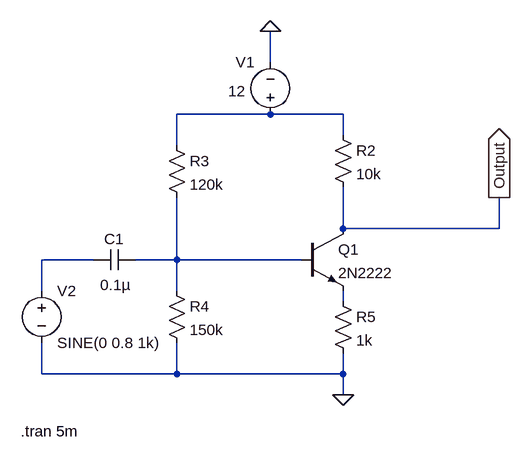
[diagram p0: schematic q3_1.asc]
q3_1.asc, the LTspice schematic file:
Version 4
SHEET 1 1488 680
WIRE -48 -176 -48 -224
WIRE -48 -96 -192 -96
WIRE 64 -96 -48 -96
WIRE 64 -64 64 -96
WIRE -192 -48 -192 -96
WIRE 64 80 64 16
WIRE 304 80 304 32
WIRE 304 80 64 80
WIRE -320 128 -400 128
WIRE -192 128 -192 32
WIRE -192 128 -256 128
WIRE 0 128 -192 128
WIRE -400 176 -400 128
WIRE -192 176 -192 128
WIRE 64 192 64 176
WIRE -400 304 -400 256
WIRE -192 304 -192 256
WIRE -192 304 -400 304
WIRE 64 304 64 272
WIRE 64 304 -192 304
WIRE 64 336 64 304
FLAG -48 -224 0
FLAG 64 336 0
FLAG 304 32 Output
IOPIN 304 32 Out
SYMBOL npn 0 80 R0
SYMATTR InstName Q1
SYMATTR Value 2N2222
SYMBOL res 48 -80 R0
SYMATTR InstName R2
SYMATTR Value 10k
SYMBOL voltage -48 -80 R180
WINDOW 0 24 96 Left 2
WINDOW 3 38 52 Left 2
WINDOW 123 0 0 Left 0
WINDOW 39 0 0 Left 0
SYMATTR InstName V1
SYMATTR Value 12
SYMBOL res -208 -64 R0
SYMATTR InstName R3
SYMATTR Value 120k
SYMBOL cap -256 112 R90
WINDOW 0 0 32 VBottom 2
WINDOW 3 39 30 VTop 2
SYMATTR InstName C1
SYMATTR Value 0.1µ
SYMBOL voltage -400 160 R0
WINDOW 123 0 0 Left 0
WINDOW 39 0 0 Left 0
SYMATTR InstName V2
SYMATTR Value SINE(0 0.8 1k)
SYMBOL res 48 176 R0
SYMATTR InstName R5
SYMATTR Value 1k
SYMBOL res -208 160 R0
SYMATTR InstName R4
SYMATTR Value 150k
TEXT -432 392 Left 2 !.tran 5m

The netlist it stands for:
* q3_1.asc
Q1 Output N003 N004 0 2N2222
R2 N001 Output 10k
V1 N001 0 12
R3 N001 N003 120k
C1 N003 N002 0.1µ
V2 N002 0 SINE(0 0.8 1k)
R5 N004 0 1k
R4 N003 0 150k
.model NPN NPN
.model PNP PNP
.lib standard.bjt
.tran 5m
.backanno
.end